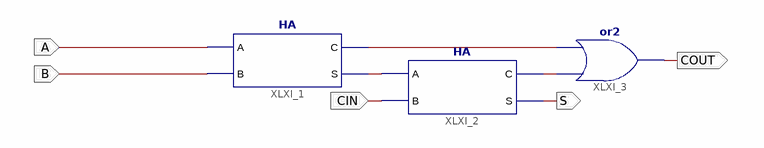
[diagram p0: schematic sheet 1]
// Xilinx ISE schematic FA.sch (spartan3e) as structural Verilog: 3 symbols, 5 ports
module FA (
  input  CIN,
  input  A,
  input  B,
  output S,
  output COUT
);

  wire XLXN_1, XLXN_3, XLXN_4;

  HA XLXI_1 (.A(A), .B(B), .C(XLXN_4), .S(XLXN_1));
  HA XLXI_2 (.A(XLXN_1), .B(CIN), .C(XLXN_3), .S(S));
  or XLXI_3 (COUT, XLXN_3, XLXN_4);
endmodule
